# Altium project diy_ir.PrjPcb
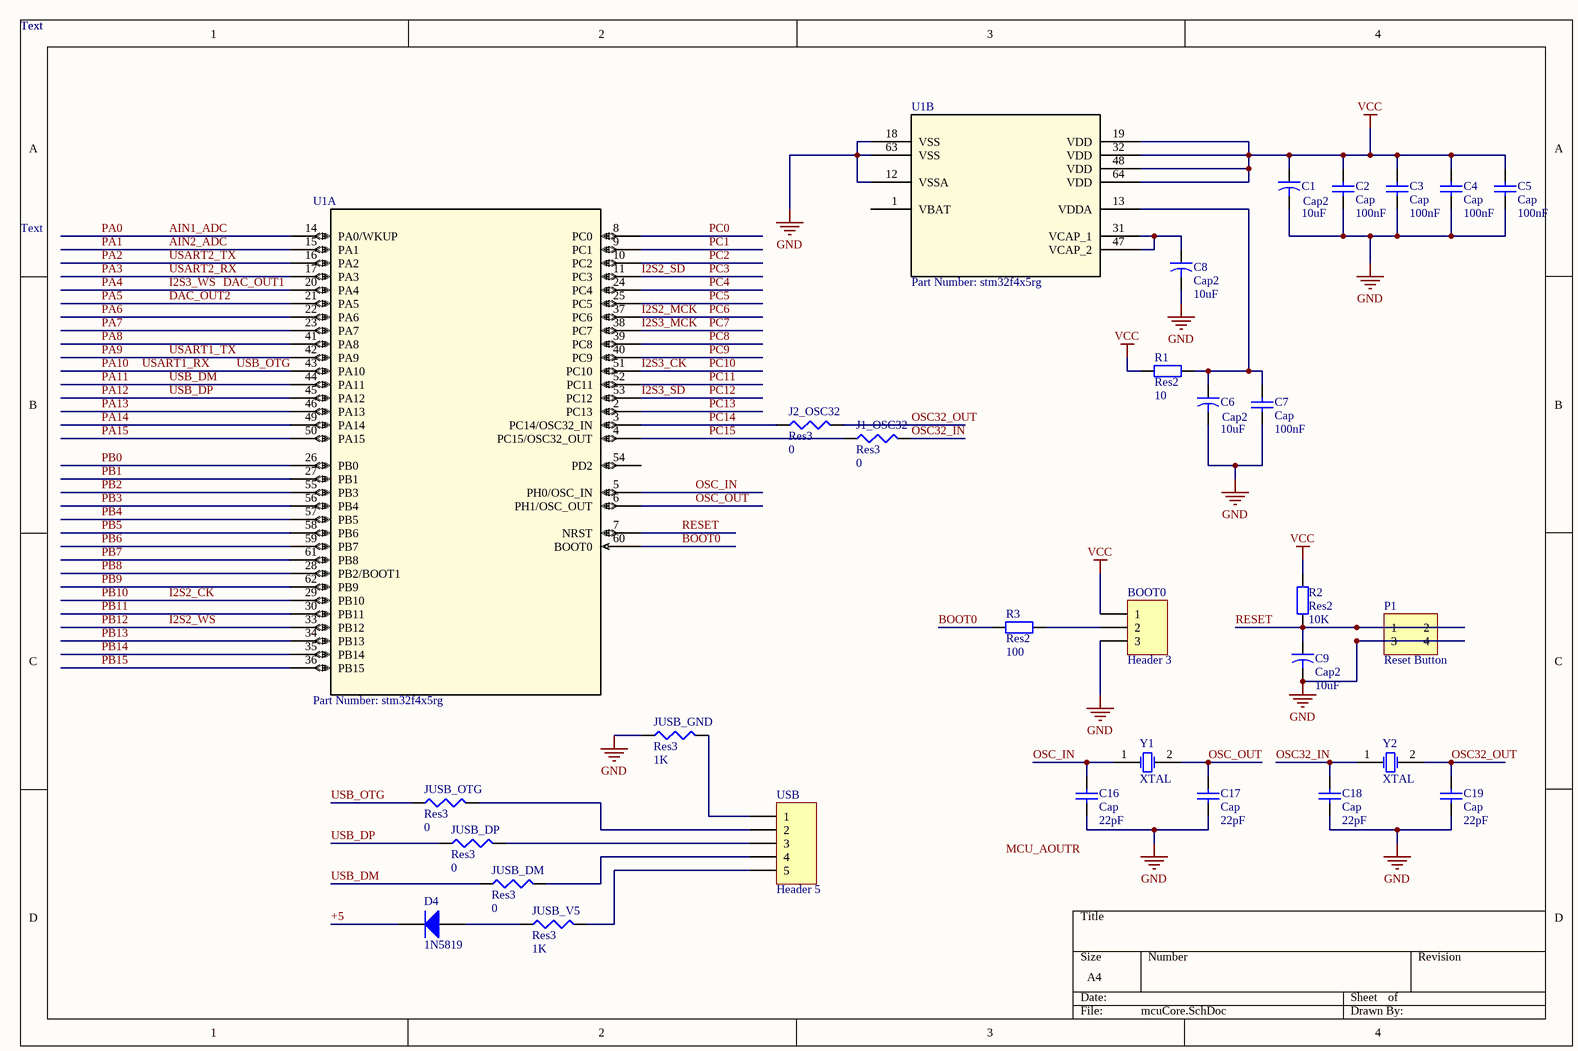
[diagram p0: mcuCore.SchDoc]
5 sheets, 117 parts. Net scope: global (net labels, ports and power ports of the same name join across sheets).
Board files: mcu.PcbDoc, mcuCore.PcbDoc, mcuv2.PcbDoc
Sheets:
  mcuCore.SchDoc
  audio.SchDoc
  irda_copy.SchDoc
  power.SchDoc
  GPIO.SchDoc

## Sheet mcuCore.SchDoc
size A4

### Parts
BOOT0  Header 3  [HDR1X3]
C1  Cap2  value 10uF  [Cap5x10]
C2  Cap  value 100nF  [1608[0603]]
C3  Cap  value 100nF  [1608[0603]]
C4  Cap  value 100nF  [1608[0603]]
C5  Cap  value 100nF  [1608[0603]]
C6  Cap2  value 10uF  [Cap5x10]
C7  Cap  value 100nF  [1608[0603]]
C8  Cap2  value 10uF  [Cap5x10]
C9  Cap2  value 10uF  [Cap5x10]
C16  Cap  value 22pF  [1608[0603]]
C17  Cap  value 22pF  [1608[0603]]
C18  Cap  value 22pF  [1608[0603]]
C19  Cap  value 22pF  [1608[0603]]
D4  1N5819  [425]
J1_OSC32  Res3  value 0  [JUMPER2]
J2_OSC32  Res3  value 0  [JUMPER2]
JUSB_DM  Res3  value 0  [JUMPER2]
JUSB_DP  Res3  value 0  [JUMPER2]
JUSB_GND  Res3  value 1K  [JUMPER2]
JUSB_OTG  Res3  value 0  [JUMPER2]
JUSB_V5  Res3  value 1K  [JUMPER2]
P1  Reset Button  [DC_Jack]
R1  Res2  value 10  [AXIAL-0.4]
R2  Res2  value 10K  [J1-0603]
R3  Res2  value 100  [J1-0603]
U1  Part Number: stm32f4x5rg  [LQFP64-10x10mm]  (parts A,B of 2)
USB  Header 5  [Micro_USB]
Y1  XTAL  [XTAL_8M]
Y2  XTAL  [XTAL_32k]

### Nets
GND: BOOT0.3 C1.2 C2.1 C3.1 C4.1 C5.1 C6.2 C7.1 C8.2 C9.2 C16.1 C17.1 C18.1 C19.1 JUSB_GND.1 P1.3 P1.4 U1.12(VSSA) U1.18(VSS) U1.63(VSS)
VCC: BOOT0.1 C1.1 C2.2 C3.2 C4.2 C5.2 R1.1 R2.2 U1.19(VDD) U1.32(VDD) U1.48(VDD) U1.64(VDD)
+5: D4.2(K)
AIN1_ADC: U1.14(PA0/WKUP)  [also labelled PA0]
AIN2_ADC: U1.15(PA1)  [also labelled PA1]
BOOT0: R3.1 U1.60(BOOT0)
DAC_OUT1: U1.20(PA4)  [also labelled I2S3_WS, PA4]
DAC_OUT2: U1.21(PA5)  [also labelled PA5]
I2S2_CK: U1.29(PB10)  [also labelled PB10]
I2S2_MCK: U1.37(PC6)  [also labelled PC6]
I2S2_SD: U1.11(PC3)  [also labelled PC3]
I2S2_WS: U1.33(PB12)  [also labelled PB12]
I2S3_CK: U1.51(PC10)  [also labelled PC10]
I2S3_MCK: U1.38(PC7)  [also labelled PC7]
I2S3_SD: U1.53(PC12)  [also labelled PC12]
OSC32_IN: C18.2 J1_OSC32.2 Y2.1(OSC1)
OSC32_OUT: C19.2 J2_OSC32.2 Y2.2(OSC2)
OSC_IN: C16.2 U1.5(PH0/OSC_IN) Y1.1(OSC1)
OSC_OUT: C17.2 U1.6(PH1/OSC_OUT) Y1.2(OSC2)
PA2: U1.16(PA2)  [also labelled USART2_TX]
PA3: U1.17(PA3)  [also labelled USART2_RX]
PA6: U1.22(PA6)
PA7: U1.23(PA7)
PA8: U1.41(PA8)
PA9: U1.42(PA9)  [also labelled USART1_TX]
PA10: JUSB_OTG.1 U1.43(PA10)  [also labelled USART1_RX, USB_OTG]
PA11: JUSB_DM.1 U1.44(PA11)  [also labelled USB_DM]
PA12: JUSB_DP.1 U1.45(PA12)  [also labelled USB_DP]
PA13: U1.46(PA13)
PA14: U1.49(PA14)
PA15: U1.50(PA15)
PB0: U1.26(PB0)
PB1: U1.27(PB1)
PB2: U1.55(PB3)
PB3: U1.56(PB4)
PB4: U1.57(PB5)
PB5: U1.58(PB6)
PB6: U1.59(PB7)
PB7: U1.61(PB8)
PB8: U1.28(PB2/BOOT1)
PB9: U1.62(PB9)
PB11: U1.30(PB11)
PB13: U1.34(PB13)
PB14: U1.35(PB14)
PB15: U1.36(PB15)
PC0: U1.8(PC0)
PC1: U1.9(PC1)
PC2: U1.10(PC2)
PC4: U1.24(PC4)
PC5: U1.25(PC5)
PC8: U1.39(PC8)
PC9: U1.40(PC9)
PC11: U1.52(PC11)
PC13: U1.2(PC13)
PC14: J2_OSC32.1 U1.3(PC14/OSC32_IN)
PC15: J1_OSC32.1 U1.4(PC15/OSC32_OUT)
RESET: C9.1 P1.1 P1.2 R2.1 U1.7(NRST)
NetBOOT0_2: BOOT0.2 R3.2
NetC6_1: C6.1 C7.2 R1.2 U1.13(VDDA)
NetC8_1: C8.1 U1.31(VCAP_1) U1.47(VCAP_2)
NetD4_1: D4.1(A) JUSB_V5.1
NetJUSB_DM_2: JUSB_DM.2 USB.4
NetJUSB_DP_2: JUSB_DP.2 USB.3
NetJUSB_GND_2: JUSB_GND.2 USB.1
NetJUSB_OTG_2: JUSB_OTG.2 USB.2
NetJUSB_V5_2: JUSB_V5.2 USB.5

Not connected (* = marked no-connect by the designer): U1 1(VBAT) 54(PD2)

### Notes on the sheet
- Text
- Labels drawn without touching a wire or pin: MCU_AOUTR

### Library data of the parts
BOOT0 = Header 3: Header, 3-Pin; LatestRevisionDate: 17-Jul-2002; LatestRevisionNote: Re-released for DXP Platform.; Publisher: Altium Limited
C1 C6 C8 C9 = Cap2: Capacitor; Published: 23-Sep-2002; PackageReference: CAPR5-4X5; Publisher: Altium Limited; PackageDescription: Capacitor; 2 Leads
C2-C5 C7 C16-C19 = Cap: Capacitor; Published: 8-Jun-2000; LatestRevisionDate: 17-Jul-2002; LatestRevisionNote: Re-released for DXP Platform.; PackageReference: RAD-0.3; Publisher: Altium Limited; PackageDescription: Radial Cap, Thru-Hole; 2 Leads; 0.3 in Pin Spacing
D4 = Diode 1N4148: High Conductance Fast Diode; Published: 8-Jun-2000; LatestRevisionDate: 17-Jul-2002; LatestRevisionNote: Re-released for DXP Platform.; DatasheetVersion: 1997; PackageReference: DO-35; Publisher: Altium Limited; PackageDescription: Diode, Axial; Body 3.8 x 1.9 mm (LxDia. max), Lead Dia. 0.53 mm (max); Code_JEDEC: DO-204-AH; ComponentLink1Description: Manufacturer Link; ComponentLink1URL: http://www.fairchildsemi.com/; ComponentLink2Description: Datasheet; ComponentLink2URL: http://www.fairchildsemi.com/ds/1N%2F1N4148.pdf
J1_OSC32 J2_OSC32 JUSB_DM JUSB_DP JUSB_GND JUSB_OTG JUSB_V5 = Res3: Resistor; Published: 8-Jun-2000; LatestRevisionDate: 29-May-2009; LatestRevisionNote: IPC-7351 Footprint Added.; PackageReference: J1-0603; Publisher: Altium Limited; PackageDescription: Chip Resistor
P1 = Header 2X2: Header, 2-Pin, Dual row; LatestRevisionDate: 17-Jul-2002; LatestRevisionNote: Re-released for DXP Platform.; Publisher: Altium Limited
R1-R3 = Res2: Resistor; Published: 8-Jun-2000; LatestRevisionDate: 17-Jul-2002; LatestRevisionNote: Re-released for DXP Platform.; PackageReference: AXIAL-0.4; Publisher: Altium Limited; PackageDescription: Axial Device, Thru-Hole; 2 Leads; 0.4 in Pin Spacing
U1 = STM32F4x5RG: No Description Available; Vendor: STMicroelectronics; Manufacturer_Part_Number: stm32f4x5rg; Copyright: Copyright (C) 2016 Accelerated Designs. All rights reserved; RefDes: RefDes; Type: DEV; Value: Value
USB = Header 5: Header, 5-Pin; LatestRevisionDate: 17-Jul-2002; LatestRevisionNote: Re-released for DXP Platform.; Publisher: Altium Limited
Y1 Y2 = XTAL: Crystal Oscillator; Published: 8-Jun-2000; LatestRevisionDate: 17-Jul-2002; LatestRevisionNote: Re-released for DXP Platform.; PackageReference: R38; Publisher: Altium Limited; PackageDescription: Crystal, Thru-Hole; 2 Leads; Body 3.1 x 8.2 mm (Dia.xH)

## Sheet audio.SchDoc
size A4
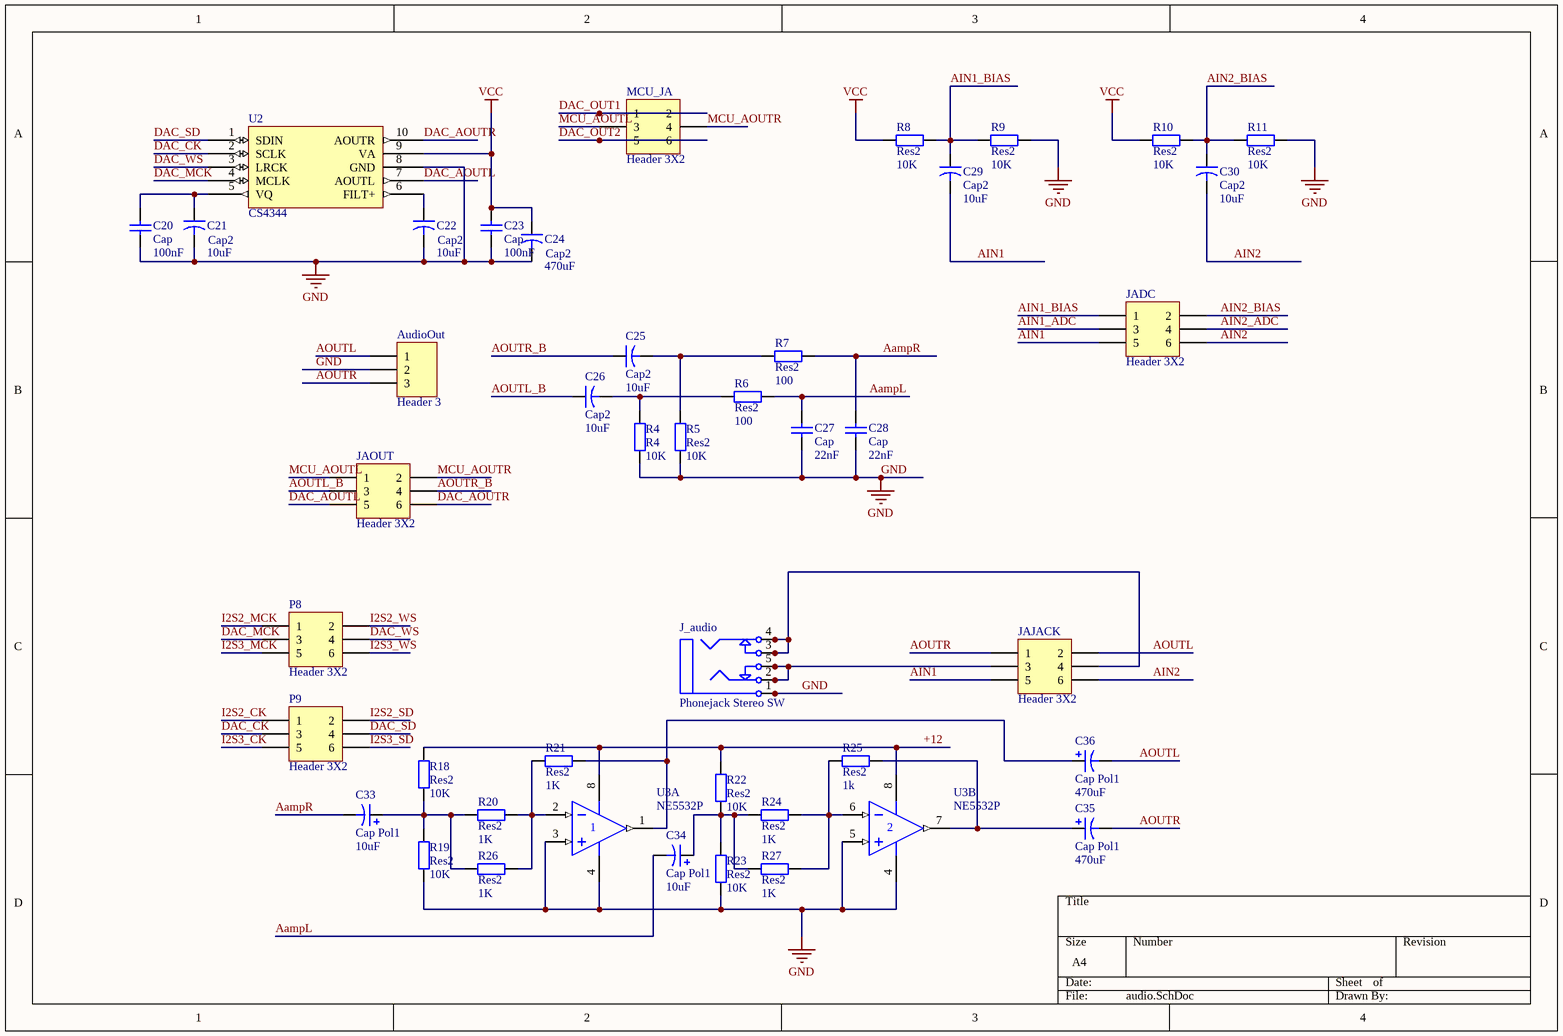
[diagram p1: audio.SchDoc]

### Parts
AudioOut  Header 3  [HDR1X3]
C20  Cap  value 100nF  [1608[0603]]
C21  Cap2  value 10uF  [Cap5x10]
C22  Cap2  value 10uF  [Cap5x10]
C23  Cap  value 100nF  [1608[0603]]
C24  Cap2  value 470uF  [Cap8*14]
C25  Cap2  value 10uF  [Cap5x10]
C26  Cap2  value 10uF  [Cap5x10]
C27  Cap  value 22nF  [1608[0603]]
C28  Cap  value 22nF  [1608[0603]]
C29  Cap2  value 10uF  [Cap5x10]
C30  Cap2  value 10uF  [Cap5x10]
C33  Cap Pol1  value 10uF  [Cap5x10]
C34  Cap Pol1  value 10uF  [Cap5x10]
C35  Cap Pol1  value 470uF  [Cap8*14]
C36  Cap Pol1  value 470uF  [Cap8*14]
J_audio  Phonejack Stereo SW  [AudioJack_3F07]
JADC  Header 3X2  [HDR2X3]
JAJACK  Header 3X2  [HDR2X3]
JAOUT  Header 3X2  [HDR2X3]
MCU_JA  Header 3X2  [HDR2X3]
P8  Header 3X2  [HDR2X3]
P9  Header 3X2  [HDR2X3]
R4  R4  value 10K  [J1-0603]
R5  Res2  value 10K  [J1-0603]
R6  Res2  value 100  [J1-0603]
R7  Res2  value 100  [J1-0603]
R8  Res2  value 10K  [J1-0603]
R9  Res2  value 10K  [J1-0603]
R10  Res2  value 10K  [J1-0603]
R11  Res2  value 10K  [J1-0603]
R18  Res2  value 10K  [J1-0603]
R19  Res2  value 10K  [J1-0603]
R20  Res2  value 1K  [J1-0603]
R21  Res2  value 1K  [J1-0603]
R22  Res2  value 10K  [J1-0603]
R23  Res2  value 10K  [J1-0603]
R24  Res2  value 1K  [J1-0603]
R25  Res2  value 1k  [J1-0603]
R26  Res2  value 1K  [J1-0603]
R27  Res2  value 1K  [J1-0603]
U2  CS4344  [CS4344]
U3  NE5532P  [P008]  (parts A,B of 2)

### Nets
+12: R18.2 R22.2 U3.8(V+)
GND: AudioOut.2 C20.1 C21.2 C22.2 C23.1 C24.2 C27.1 C28.1 J_audio.1 J_audio.1A J_audio.1B R4.1 R5.1 R9.2 R11.2 R19.1 R23.1 U2.8(GND) U3.3(IN+) U3.4(V-) U3.5(IN+)
VCC: C23.2 C24.1 R8.1 R10.1 U2.9(VA)
AampL: C27.2 C34.2 R6.2
AampR: C28.2 C33.2 R7.2
AIN1: C29.2 JADC.5 JAJACK.5
AIN1_ADC: JADC.3
AIN1_BIAS: C29.1 JADC.1 R8.2 R9.1
AIN2: C30.2 JADC.6 JAJACK.6
AIN2_ADC: JADC.4
AIN2_BIAS: C30.1 JADC.2 R10.2 R11.1
AOUTL: AudioOut.1 C36.2 JAJACK.2
AOUTL_B: C26.1 JAOUT.3
AOUTR: AudioOut.3 C35.2 JAJACK.1
AOUTR_B: C25.1 JAOUT.4
DAC_AOUTL: JAOUT.5 U2.7(AOUTL)
DAC_AOUTR: JAOUT.6 U2.10(AOUTR)
DAC_CK: P9.3 U2.2(SCLK)
DAC_MCK: P8.3 U2.4(MCLK)
DAC_OUT1: MCU_JA.1 MCU_JA.2 P8.6  [also labelled I2S3_WS]
DAC_OUT2: MCU_JA.5 MCU_JA.6
DAC_SD: P9.4 U2.1(SDIN)
DAC_WS: P8.4 U2.3(LRCK)
I2S2_CK: P9.1
I2S2_MCK: P8.1
I2S2_SD: P9.2
I2S2_WS: P8.2
I2S3_CK: P9.5
I2S3_MCK: P8.5
I2S3_SD: P9.6
MCU_AOUTL: JAOUT.1 MCU_JA.3
MCU_AOUTR: JAOUT.2 MCU_JA.4
NetC20_2: C20.2 C21.1 U2.5(VQ)
NetC22_1: C22.1 U2.6(FILT+)
NetC25_2: C25.2 R5.2 R7.1
NetC26_2: C26.2 R4.2 R6.1
NetC33_1: C33.1 R18.1 R19.2 R20.2 R26.2
NetC34_1: C34.1 R22.1 R23.2 R24.2 R27.2
NetC35_1: C35.1 R25.1 U3.7(OUT)
NetC36_1: C36.1 R21.1 U3.1(OUT)
NetJ_audio_2: J_audio.2 J_audio.2A J_audio.2B J_audio.5 J_audio.5A J_audio.5B JAJACK.3
NetJ_audio_3: J_audio.3 J_audio.3A J_audio.3B J_audio.4 J_audio.4A J_audio.4B JAJACK.4
NetR20_1: R20.1 R21.2 R26.1 U3.2(IN-)
NetR24_1: R24.1 R25.2 R27.1 U3.6(IN-)

### Library data of the parts
AudioOut = Header 3: Header, 3-Pin; LatestRevisionDate: 17-Jul-2002; LatestRevisionNote: Re-released for DXP Platform.; Publisher: Altium Limited
C20 C23 C27 C28 = Cap: Capacitor; Published: 8-Jun-2000; LatestRevisionDate: 17-Jul-2002; LatestRevisionNote: Re-released for DXP Platform.; PackageReference: RAD-0.3; Publisher: Altium Limited; PackageDescription: Radial Cap, Thru-Hole; 2 Leads; 0.3 in Pin Spacing
C21 C22 C24-C26 C29 C30 = Cap2: Capacitor; Published: 23-Sep-2002; PackageReference: CAPR5-4X5; Publisher: Altium Limited; PackageDescription: Capacitor; 2 Leads
C33-C36 = Cap Pol1: Polarized Capacitor (Radial); Published: 8-Jun-2000; LatestRevisionDate: 17-Jul-2002; LatestRevisionNote: Re-released for DXP Platform.; PackageReference: RB7.6-15; Publisher: Altium Limited; PackageDescription: Polarized Capacitor (Radial); 2 Leads
J_audio = Phonejack Stereo SW: 3-Conductor Jack with 2 break contacts (normals) and 2 auxiliary make contacts; pin to pad: 1A>0 1B>0 2A>0 2B>0 3>5 3A>0 3B>0 4A>0 4B>0 5>3 5A>0 5B>0; Published: 5-Jan-2004; LatestRevisionDate: 17-Dec-2003; LatestRevisionNote: PCB Footprint replaced.; DatasheetDocument: 07-Mar-2000; Publisher: Altium Limited; ComponentLink1Description: Manufacturer Link; ComponentLink1URL: http://domino.kycon.com/internet/Products.html
JADC JAJACK JAOUT MCU_JA P8 P9 = Header 3X2: Header, 3-Pin, Dual row; LatestRevisionDate: 17-Jul-2002; LatestRevisionNote: Re-released for DXP Platform.; Publisher: Altium Limited
R4-R11 R18-R27 = Res2: Resistor; Published: 8-Jun-2000; LatestRevisionDate: 17-Jul-2002; LatestRevisionNote: Re-released for DXP Platform.; PackageReference: AXIAL-0.4; Publisher: Altium Limited; PackageDescription: Axial Device, Thru-Hole; 2 Leads; 0.4 in Pin Spacing
U3 = NE5532P: Dual Low-Noise Operational Amplifier; Published: 15-Apr-2002; LatestRevisionDate: 04-Mar-2005; LatestRevisionNote: Stylized 3D Model Added.; DatasheetVersion: May-1988; PackageVersion: Jun-1999; PackageReference: P008; Publisher: Altium Limited; PackageDescription: DIP; 8 Leads; Row Spacing 7.62 mm; Pitch 2.54 mm; Code_JEDEC: MO-001-AN; ComponentLink1Description: Manufacturer Link; ComponentLink1URL: http://www.ti.com/; ComponentLink2Description: Datasheet; ComponentLink2URL: http://www-s.ti.com/sc/ds/ne5532a.pdf

## Sheet irda_copy.SchDoc
size A4
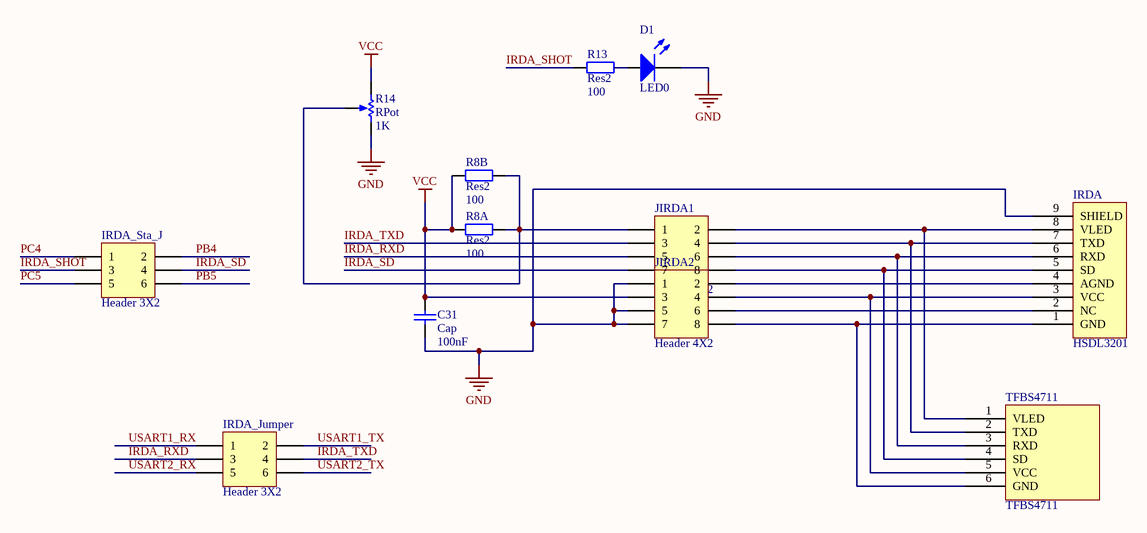
[diagram p2: irda_copy.SchDoc]

### Parts
C31  Cap  value 100nF  [1608[0603]]
D1  LED0  [Cap5x10]
IRDA  HSDL3201  [HSDL3201]
IRDA_Jumper  Header 3X2  [HDR2X3]
IRDA_Sta_J  Header 3X2  [HDR2X3]
JIRDA1  Header 4X2  [HDR2X4]
JIRDA2  Header 4X2  [HDR2X4]
R8A  Res2  value 100  [J1-0603]
R8B  Res2  value 100  [J1-0603]
R13  Res2  value 100  [J1-0603]
R14  RPot  value 1K  [VR5]
TFBS4711  TFBS4711  [TFBS4711]

### Nets
GND: C31.1 D1.2(K) IRDA.9(SHIELD) JIRDA2.1 JIRDA2.5 JIRDA2.7 R14.2(BOT)
VCC: C31.2 JIRDA2.3 R8A.2 R8B.2 R14.1(TOP)
IRDA_RXD: IRDA_Jumper.3 JIRDA1.5
IRDA_SD: IRDA_Sta_J.4 JIRDA1.7
IRDA_SHOT: IRDA_Sta_J.3 R13.1
IRDA_TXD: IRDA_Jumper.4 JIRDA1.3
PB4: IRDA_Sta_J.2
PB5: IRDA_Sta_J.6
PC4: IRDA_Sta_J.1
PC5: IRDA_Sta_J.5
USART1_RX: IRDA_Jumper.1  [project net PA10]
USART1_TX: IRDA_Jumper.2  [project net PA9]
USART2_RX: IRDA_Jumper.5  [project net PA3]
USART2_TX: IRDA_Jumper.6  [project net PA2]
NetD1_1: D1.1(A) R13.2
NetIRDA_1: IRDA.1(GND) JIRDA2.8 TFBS4711.6(GND)
NetIRDA_2: IRDA.2(NC) JIRDA2.6
NetIRDA_3: IRDA.3(VCC) JIRDA2.4 TFBS4711.5(VCC)
NetIRDA_4: IRDA.4(AGND) JIRDA2.2
NetIRDA_5: IRDA.5(SD) JIRDA1.8 TFBS4711.4(SD)
NetIRDA_6: IRDA.6(RXD) JIRDA1.6 TFBS4711.3(RXD)
NetIRDA_7: IRDA.7(TXD) JIRDA1.4 TFBS4711.2(TXD)
NetIRDA_8: IRDA.8(VLED) JIRDA1.2 TFBS4711.1(VLED)
NetJIRDA1_1: JIRDA1.1 R8A.1 R8B.1 R14.3(TAP)

### Library data of the parts
C31 = Cap: Capacitor; Published: 8-Jun-2000; LatestRevisionDate: 17-Jul-2002; LatestRevisionNote: Re-released for DXP Platform.; PackageReference: RAD-0.3; Publisher: Altium Limited; PackageDescription: Radial Cap, Thru-Hole; 2 Leads; 0.3 in Pin Spacing
D1 = LED0: Typical INFRARED GaAs LED; Published: 8-Jun-2000; LatestRevisionDate: 08-Jul-2005; LatestRevisionNote: Mech Layer 1 removed.; PackageReference: LED-0; Publisher: Altium Limited; PackageDescription: LED; 2 Leads
IRDA_Jumper IRDA_Sta_J = Header 3X2: Header, 3-Pin, Dual row; LatestRevisionDate: 17-Jul-2002; LatestRevisionNote: Re-released for DXP Platform.; Publisher: Altium Limited
JIRDA1 JIRDA2 = Header 4X2: Header, 4-Pin, Dual row; LatestRevisionDate: 17-Jul-2002; LatestRevisionNote: Re-released for DXP Platform.; Publisher: Altium Limited
R8A R8B R13 = Res2: Resistor; Published: 8-Jun-2000; LatestRevisionDate: 17-Jul-2002; LatestRevisionNote: Re-released for DXP Platform.; PackageReference: AXIAL-0.4; Publisher: Altium Limited; PackageDescription: Axial Device, Thru-Hole; 2 Leads; 0.4 in Pin Spacing
R14 = RPot: Potentiometer; pin to pad: 1>3 2>1 3>2; Sim Note: Enter the Resistance value and the set point into parameter fields.; Set Position: 0.5; Published: 8-Jun-2000; LatestRevisionDate: 17-Jul-2002; LatestRevisionNote: Re-released for DXP Platform.; PackageReference: VR5; Publisher: Altium Limited; PackageDescription: Variable Resistor, Thru-Hole; 3 Leads

## Sheet power.SchDoc
size A4
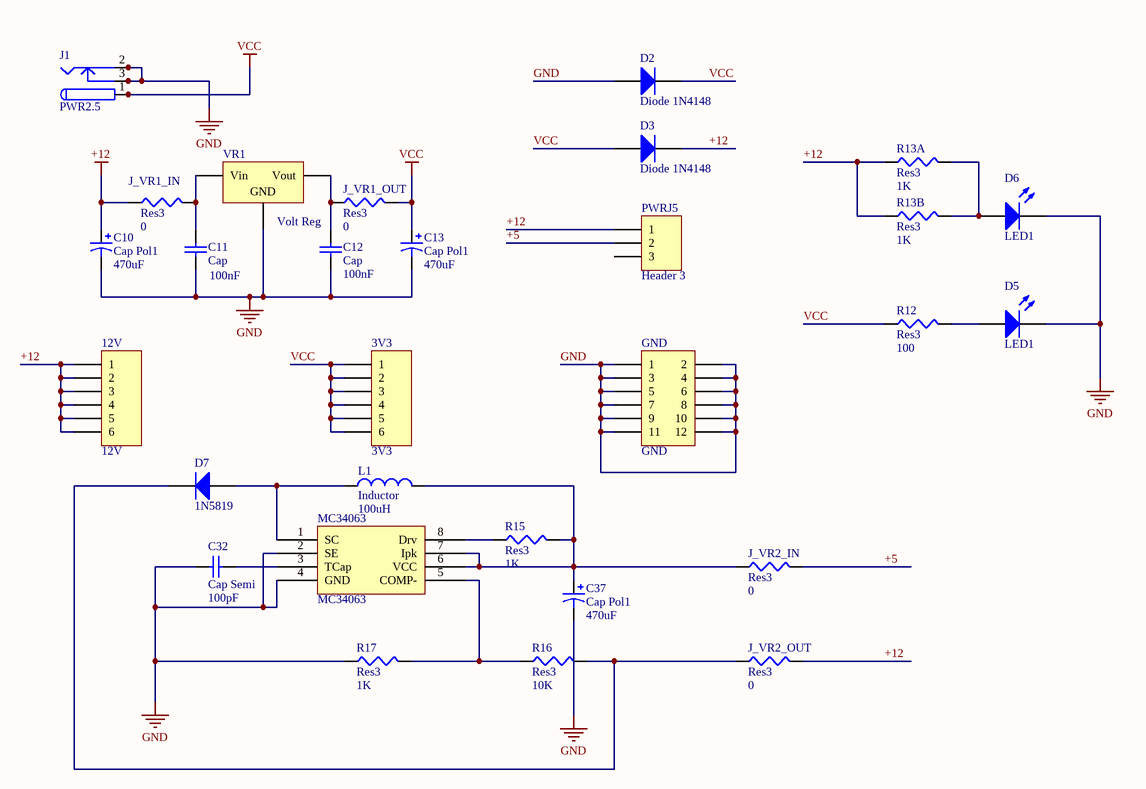
[diagram p3: power.SchDoc]

### Parts
3V3  3V3  [HDR1X6]
12V  12V  [HDR1X6]
C10  Cap Pol1  value 470uF  [Cap8*14]
C11  Cap  value 100nF  [1608[0603]]
C12  Cap  value 100nF  [1608[0603]]
C13  Cap Pol1  value 470uF  [Cap8*14]
C32  Cap Semi  value 100pF  [1608[0603]]
C37  Cap Pol1  value 470uF  [Cap8*14]
D2  Diode 1N4148  [DO-35]
D3  Diode 1N4148  [DO-35]
D5  LED1  [Cap5x10]
D6  LED1  [Cap5x10]
D7  1N5819  [425]
GND  GND  [HDR2X6]
J1  PWR2.5  [PCBComponent_1]
J_VR1_IN  Res3  value 0  [JUMPER2]
J_VR1_OUT  Res3  value 0  [JUMPER2]
J_VR2_IN  Res3  value 0  [JUMPER2]
J_VR2_OUT  Res3  value 0  [JUMPER2]
L1  Inductor  value 100uH  [Cap8*14]
MC34063  MC34063  [MC34063]
PWRJ5  Header 3  [HDR1X3]
R12  Res3  value 100  [J1-0603]
R13A  Res3  value 1K  [J1-0603]
R13B  Res3  value 1K  [J1-0603]
R15  Res3  value 1K  [J1-0603]
R16  Res3  value 10K  [J1-0603]
R17  Res3  value 1K  [J1-0603]
VR1  Volt Reg  [SOT223_L]

### Nets
+12: 12V.1 12V.2 12V.3 12V.4 12V.5 12V.6 C10.1 D3.2(K) J_VR1_IN.1 J_VR2_OUT.2 PWRJ5.1 R13A.1 R13B.1
GND: C10.2 C11.1 C12.1 C13.2 C32.1 C37.2 D2.1(A) D5.2(K) D6.2(K) GND.1 GND.2 GND.3 GND.4 GND.5 GND.6 GND.7 GND.8 GND.9 GND.10 GND.11 GND.12 J1.2 J1.2A J1.2B J1.3 J1.3A J1.3B MC34063.2(SE) MC34063.4(GND) R17.1 VR1.2(GND)
VCC: 3V3.1 3V3.2 3V3.3 3V3.4 3V3.5 3V3.6 C13.1 D2.2(K) D3.1(A) J1.1 J1.1A J1.1B J_VR1_OUT.2 R12.1
+5: J_VR2_IN.2 PWRJ5.2
NetC11_2: C11.2 J_VR1_IN.2 VR1.1(Vin)
NetC12_2: C12.2 J_VR1_OUT.1 VR1.3(Vout)
NetC32_2: C32.2 MC34063.3(TCap)
NetC37_1: C37.1 J_VR2_IN.1 L1.2 MC34063.6(VCC) MC34063.7(Ipk) R15.2
NetD5_1: D5.1(A) R12.2
NetD6_1: D6.1(A) R13A.2 R13B.2
NetD7_1: D7.1(A) L1.1 MC34063.1(SC)
NetD7_2: D7.2(K) J_VR2_OUT.1 R16.2
NetMC34063_5: MC34063.5(COMP-) R16.1 R17.2
NetMC34063_8: MC34063.8(Drv) R15.1

Not connected (* = marked no-connect by the designer): PWRJ5 3

### Library data of the parts
3V3 12V = Header 6: Header, 6-Pin; LatestRevisionDate: 17-Jul-2002; LatestRevisionNote: Re-released for DXP Platform.; Publisher: Altium Limited
C10 C13 C37 = Cap Pol1: Polarized Capacitor (Radial); Published: 8-Jun-2000; LatestRevisionDate: 17-Jul-2002; LatestRevisionNote: Re-released for DXP Platform.; PackageReference: RB7.6-15; Publisher: Altium Limited; PackageDescription: Polarized Capacitor (Radial); 2 Leads
C11 C12 = Cap: Capacitor; Published: 8-Jun-2000; LatestRevisionDate: 17-Jul-2002; LatestRevisionNote: Re-released for DXP Platform.; PackageReference: RAD-0.3; Publisher: Altium Limited; PackageDescription: Radial Cap, Thru-Hole; 2 Leads; 0.3 in Pin Spacing
C32 = Cap Semi: Capacitor (Semiconductor SIM Model); Published: 8-Jun-2000; LatestRevisionDate: 29-May-2009; LatestRevisionNote: IPC-7351 Footprint Added.; PackageReference: C1206; Publisher: Altium Limited; PackageDescription: Chip Capacitor
D2 D3 D7 = Diode 1N4148: High Conductance Fast Diode; Published: 8-Jun-2000; LatestRevisionDate: 17-Jul-2002; LatestRevisionNote: Re-released for DXP Platform.; DatasheetVersion: 1997; PackageReference: DO-35; Publisher: Altium Limited; PackageDescription: Diode, Axial; Body 3.8 x 1.9 mm (LxDia. max), Lead Dia. 0.53 mm (max); Code_JEDEC: DO-204-AH; ComponentLink1Description: Manufacturer Link; ComponentLink1URL: http://www.fairchildsemi.com/; ComponentLink2Description: Datasheet; ComponentLink2URL: http://www.fairchildsemi.com/ds/1N%2F1N4148.pdf
D5 D6 = LED1: Typical RED GaAs LED; Published: 8-Jun-2000; LatestRevisionDate: 08-Jul-2005; LatestRevisionNote: Mech Layer 1 removed.; PackageReference: LED-1; Publisher: Altium Limited; PackageDescription: LED; 2 Leads
GND = Header 6X2: Header, 6-Pin, Dual row; LatestRevisionDate: 17-Jul-2002; LatestRevisionNote: Re-released for DXP Platform.; Publisher: Altium Limited
J1 = PWR2.5: Low Voltage Power Supply Connector; pin to pad: 1>3 1A>0 1B>0 2A>0 2B>0 3>1 3A>0 3B>0; Published: 17-Dec-2003; DatasheetDocument: 09-May-2002; Publisher: Altium Limited; ComponentLink1Description: Manufacturer Link; ComponentLink1URL: http://domino.kycon.com/internet/Products.html
J_VR1_IN J_VR1_OUT J_VR2_IN J_VR2_OUT R12 R13A R13B R15-R17 = Res3: Resistor; Published: 8-Jun-2000; LatestRevisionDate: 29-May-2009; LatestRevisionNote: IPC-7351 Footprint Added.; PackageReference: J1-0603; Publisher: Altium Limited; PackageDescription: Chip Resistor
L1 = Inductor: Code_IEC: 1005; Published: 8-Jun-2000; LatestRevisionDate: 29-May-2009; LatestRevisionNote: IPC-7351 Footprint Added.; PackageReference: 0402-A; Publisher: Altium Limited; PackageDescription: Chip Inductor; Code_JEITA: 0402
PWRJ5 = Header 3: Header, 3-Pin; LatestRevisionDate: 17-Jul-2002; LatestRevisionNote: Re-released for DXP Platform.; Publisher: Altium Limited
VR1 = Volt Reg: Voltage Regulator; pin to pad: 1>3 2>1 3>2; Published: 24-Mar-1999; LatestRevisionDate: 29-May-2009; LatestRevisionNote: IPC-7351 Footprint Added.; PackageReference: D2PAK; Publisher: Altium Limited; PackageDescription: 3-Pin Transistor Outline Package 2.54 mm Pitch, 15.1 mm Lead Span

## Sheet GPIO.SchDoc
size A4
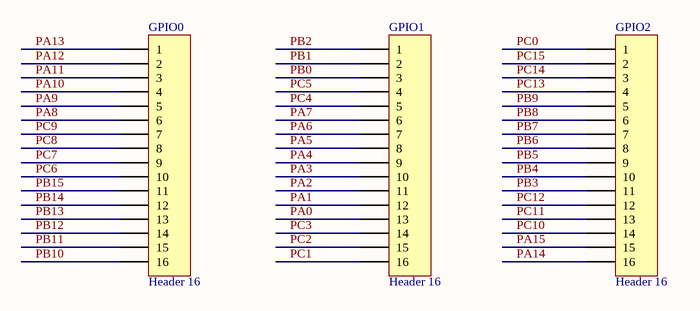
[diagram p4: GPIO.SchDoc]

### Parts
GPIO0  Header 16  [HDR1X16]
GPIO1  Header 16  [HDR1X16]
GPIO2  Header 16  [HDR1X16]

### Nets
PA0: GPIO1.13  [project net AIN1_ADC]
PA1: GPIO1.12  [project net AIN2_ADC]
PA2: GPIO1.11
PA3: GPIO1.10
PA4: GPIO1.9  [project net DAC_OUT1]
PA5: GPIO1.8  [project net DAC_OUT2]
PA6: GPIO1.7
PA7: GPIO1.6
PA8: GPIO0.6
PA9: GPIO0.5
PA10: GPIO0.4
PA11: GPIO0.3
PA12: GPIO0.2
PA13: GPIO0.1
PA14: GPIO2.16
PA15: GPIO2.15
PB0: GPIO1.3
PB1: GPIO1.2
PB2: GPIO1.1
PB3: GPIO2.11
PB4: GPIO2.10
PB5: GPIO2.9
PB6: GPIO2.8
PB7: GPIO2.7
PB8: GPIO2.6
PB9: GPIO2.5
PB10: GPIO0.16  [project net I2S2_CK]
PB11: GPIO0.15
PB12: GPIO0.14  [project net I2S2_WS]
PB13: GPIO0.13
PB14: GPIO0.12
PB15: GPIO0.11
PC0: GPIO2.1
PC1: GPIO1.16
PC2: GPIO1.15
PC3: GPIO1.14  [project net I2S2_SD]
PC4: GPIO1.5
PC5: GPIO1.4
PC6: GPIO0.10  [project net I2S2_MCK]
PC7: GPIO0.9  [project net I2S3_MCK]
PC8: GPIO0.8
PC9: GPIO0.7
PC10: GPIO2.14  [project net I2S3_CK]
PC11: GPIO2.13
PC12: GPIO2.12  [project net I2S3_SD]
PC13: GPIO2.4
PC14: GPIO2.3
PC15: GPIO2.2

### Library data of the parts
GPIO0-GPIO2 = Header 16: Header, 16-Pin; LatestRevisionDate: 17-Jul-2002; LatestRevisionNote: Re-released for DXP Platform.; Publisher: Altium Limited

## Nets that join several sheets
+12: audio (R18.2 R22.2 U3.8), power (13 pins)
GND: mcuCore (20 pins), audio (21 pins), irda_copy (7 pins), power (31 pins)
VCC: mcuCore (12 pins), audio (5 pins), irda_copy (5 pins), power (14 pins)
+5: mcuCore (D4.2), power (J_VR2_IN.2 PWRJ5.2)
AIN1_ADC: mcuCore (U1.14), audio (JADC.3), GPIO (GPIO1.13)
AIN2_ADC: mcuCore (U1.15), audio (JADC.4), GPIO (GPIO1.12)
DAC_OUT1: mcuCore (U1.20), audio (MCU_JA.1 MCU_JA.2 P8.6), GPIO (GPIO1.9)
DAC_OUT2: mcuCore (U1.21), audio (MCU_JA.5 MCU_JA.6), GPIO (GPIO1.8)
I2S2_CK: mcuCore (U1.29), audio (P9.1), GPIO (GPIO0.16)
I2S2_MCK: mcuCore (U1.37), audio (P8.1), GPIO (GPIO0.10)
I2S2_SD: mcuCore (U1.11), audio (P9.2), GPIO (GPIO1.14)
I2S2_WS: mcuCore (U1.33), audio (P8.2), GPIO (GPIO0.14)
I2S3_CK: mcuCore (U1.51), audio (P9.5), GPIO (GPIO2.14)
I2S3_MCK: mcuCore (U1.38), audio (P8.5), GPIO (GPIO0.9)
I2S3_SD: mcuCore (U1.53), audio (P9.6), GPIO (GPIO2.12)
PA2: mcuCore (U1.16), irda_copy (IRDA_Jumper.6), GPIO (GPIO1.11)
PA3: mcuCore (U1.17), irda_copy (IRDA_Jumper.5), GPIO (GPIO1.10)
PA6: mcuCore (U1.22), GPIO (GPIO1.7)
PA7: mcuCore (U1.23), GPIO (GPIO1.6)
PA8: mcuCore (U1.41), GPIO (GPIO0.6)
PA9: mcuCore (U1.42), irda_copy (IRDA_Jumper.2), GPIO (GPIO0.5)
PA10: mcuCore (JUSB_OTG.1 U1.43), irda_copy (IRDA_Jumper.1), GPIO (GPIO0.4)
PA11: mcuCore (JUSB_DM.1 U1.44), GPIO (GPIO0.3)
PA12: mcuCore (JUSB_DP.1 U1.45), GPIO (GPIO0.2)
PA13: mcuCore (U1.46), GPIO (GPIO0.1)
PA14: mcuCore (U1.49), GPIO (GPIO2.16)
PA15: mcuCore (U1.50), GPIO (GPIO2.15)
PB0: mcuCore (U1.26), GPIO (GPIO1.3)
PB1: mcuCore (U1.27), GPIO (GPIO1.2)
PB2: mcuCore (U1.55), GPIO (GPIO1.1)
PB3: mcuCore (U1.56), GPIO (GPIO2.11)
PB4: mcuCore (U1.57), irda_copy (IRDA_Sta_J.2), GPIO (GPIO2.10)
PB5: mcuCore (U1.58), irda_copy (IRDA_Sta_J.6), GPIO (GPIO2.9)
PB6: mcuCore (U1.59), GPIO (GPIO2.8)
PB7: mcuCore (U1.61), GPIO (GPIO2.7)
PB8: mcuCore (U1.28), GPIO (GPIO2.6)
PB9: mcuCore (U1.62), GPIO (GPIO2.5)
PB11: mcuCore (U1.30), GPIO (GPIO0.15)
PB13: mcuCore (U1.34), GPIO (GPIO0.13)
PB14: mcuCore (U1.35), GPIO (GPIO0.12)
PB15: mcuCore (U1.36), GPIO (GPIO0.11)
PC0: mcuCore (U1.8), GPIO (GPIO2.1)
PC1: mcuCore (U1.9), GPIO (GPIO1.16)
PC2: mcuCore (U1.10), GPIO (GPIO1.15)
PC4: mcuCore (U1.24), irda_copy (IRDA_Sta_J.1), GPIO (GPIO1.5)
PC5: mcuCore (U1.25), irda_copy (IRDA_Sta_J.5), GPIO (GPIO1.4)
PC8: mcuCore (U1.39), GPIO (GPIO0.8)
PC9: mcuCore (U1.40), GPIO (GPIO0.7)
PC11: mcuCore (U1.52), GPIO (GPIO2.13)
PC13: mcuCore (U1.2), GPIO (GPIO2.4)
PC14: mcuCore (J2_OSC32.1 U1.3), GPIO (GPIO2.3)
PC15: mcuCore (J1_OSC32.1 U1.4), GPIO (GPIO2.2)